# EasyEDA Pro project ProPrj_bspd _new_2026-05-23.epro

# Schematic Schematic1
Board Name: Board1; Create Date: 2026-03-17; Page Name: P1; Project Name: bspd 2; Schematic Name: Schematic1; Update Date: 2026-03-18; BladeWidth: 10; Company: 嘉立创EDA; Page Size: A4; RegionStart: 1; ShowBorder: 1; TitleBlock: 1; TitleBlockPosition: 3; Version: V1.0; XRegionCount: 6; YRegionCount: 4
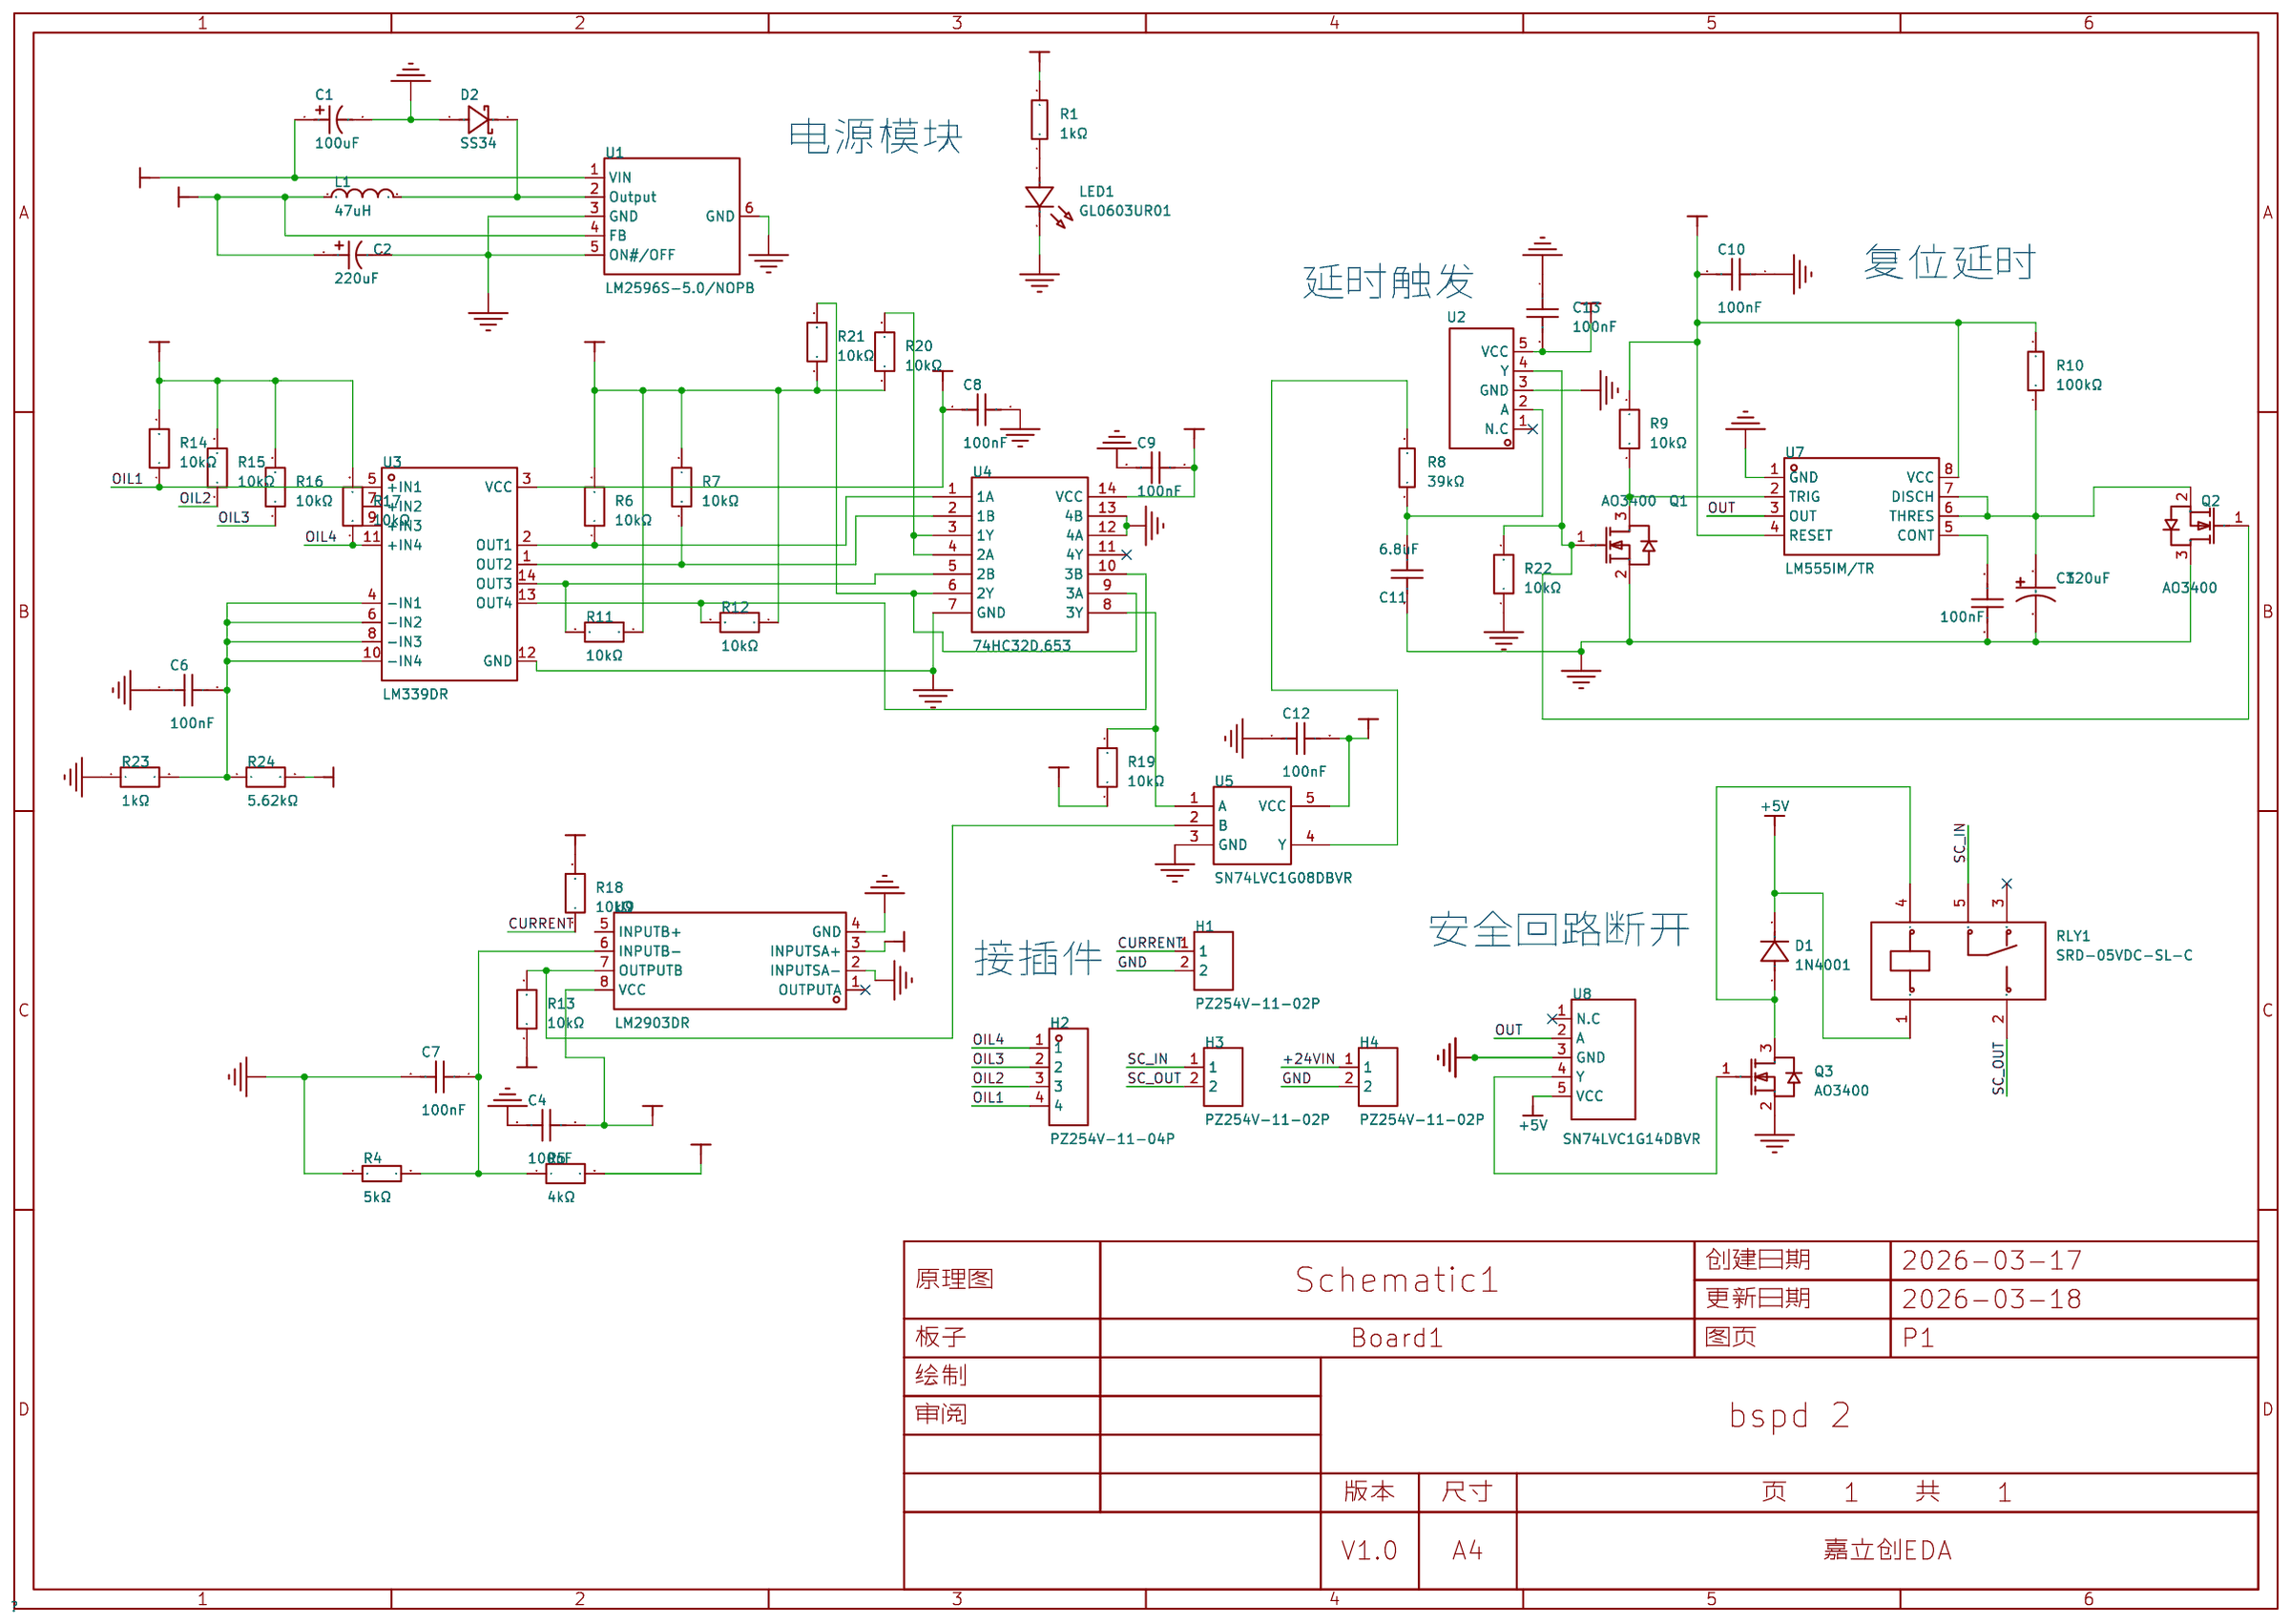
[diagram p0: schematic sheet]

## Parts
C1  100uF  [CAP-SMD_BD6.3-L6.6-W6.6-LS7.3-FD-H7.7]
C2  220uF  [CAP-SMD_BD10.0-L10.3-W10.3-LS11.7-FD]
C3  120uF  [CAP-SMD_BD6.3-L6.6-W6.6-LS7.2-FD]
C4  100nF  [C0603]
C5  100nF  [C0603]
C6  100nF  [C0603]
C7  100nF  [C0603]
C8  100nF  [C0603]
C9  100nF  [C0603]
C10  100nF  [C0603]
C11  6.8uF  [C1206]
C12  100nF  [C0603]
C13  100nF  [C0603]
D1  1N4001  [SMA_L4.3-W2.5-LS5.0-RD]
D2  SS34  [SMA_L4.3-W2.6-LS5.0-FD]
H1  PZ254V-11-02P  [HDR-TH_2P-P2.54-V-M]
H2  PZ254V-11-04P  [HDR-TH_4P-P2.54-V-M]
H3  PZ254V-11-02P  [HDR-TH_2P-P2.54-V-M]
H4  PZ254V-11-02P  [HDR-TH_2P-P2.54-V-M]
L1  47uH  [IND-SMD_L11.5-W10.5_MJC-1040T]
LED1  GL0603UR01  [LED0603-FD]
Q1  AO3400  [SOT-23_L2.9-W1.3-P1.90-LS2.4-BR]
Q2  AO3400  [SOT-23_L2.9-W1.3-P1.90-LS2.4-BR]
Q3  AO3400  [SOT-23_L2.9-W1.3-P1.90-LS2.4-BR]
R1  1kΩ  [R0603]
R4  5kΩ  [R0603]
R5  4kΩ  [R0603]
R6  10kΩ  [R0603]
R7  10kΩ  [R0603]
R8  39kΩ  [R0603]
R9  10kΩ  [R0603]
R10  100kΩ  [R0603]
R11  10kΩ  [R0603]
R12  10kΩ  [R0603]
R13  10kΩ  [R0603]
R14  10kΩ  [R0603]
R15  10kΩ  [R0603]
R16  10kΩ  [R0603]
R17  10kΩ  [R0603]
R18  10kΩ  [R0603]
R19  10kΩ  [R0603]
R20  10kΩ  [R0603]
R21  10kΩ  [R0603]
R22  10kΩ  [R0603]
R23  1kΩ  [R0603]
R24  5.62kΩ  [R0603]
RLY1  SRD-05VDC-SL-C  [RELAY-TH_SRD-XXVDC-XL-C]
U1  LM2596S-5.0/NOPB  [TO-263-5_L10.2-W8.6-P1.70-LS14.4-BR]
U2  SN74LVC1G17DBVR  [SOT-23-5_L3.0-W1.7-P0.95-LS2.8-BR]
U3  LM339DR  [SOIC-14_L8.7-W3.9-P1.27-LS6.0-BL]
U4  74HC32D,653  [SOIC-14_L8.7-W3.9-P1.27-LS6.0-BL]
U5  SN74LVC1G08DBVR  [SOT-23-5_L3.0-W1.7-P0.95-LS2.8-BR]
U7  LM555IM/TR  [SOIC-8_L4.9-W3.9-P1.27-LS6.0-BL]
U8  SN74LVC1G14DBVR  [SOT-23-5_L3.0-W1.7-P0.95-LS2.8-BR]
U9  LM2903DR  [SOP-8_L4.9-W3.9-P1.27-LS6.0-BL]

## Library data of the parts
C1 = RVT50V100M6X8: 容值:100uF;精度:±20%;额定电压:50V;纹波电流:146mA@120Hz;; LCSC Part Name: 100uF ±20% 50V; Supplier Part: C47023117; Manufacturer: JIERR(捷而瑞); Supplier Footprint: SMD,D6.3xL7.7mm; JLCPCB Part Class: Extended Part; Datasheet: https://item.szlcsc.com/datasheet/RVT50V100M6X8/49206218.html; Supplier: LCSC; Tolerance: ±20%; Voltage Rating: 50V; Ripple Current: 146mA@120Hz; Diameter: 6.3mm; Height - Seated (Max): 7.7mm; Lifetime: 2000hrs@105℃; Operating Temperature: -55℃~+105℃
C2 = JVJ50V220M10x10: 容值:220uF;精度:±20%;额定电压:50V;纹波电流:220mA@120Hz;; LCSC Part Name: 220uF ±20% 50V; Supplier Part: C46550417; Manufacturer: JIERR(捷而瑞); Supplier Footprint: SMD,D10xL10.5mm; JLCPCB Part Class: Extended Part; Datasheet: https://item.szlcsc.com/datasheet/JVJ50V220M10x10/48680111.html; Supplier: LCSC; Tolerance: ±20%; Voltage Rating: 50V; Ripple Current: 220mA@120Hz; Diameter: 10mm; Height - Seated (Max): 10.5mm; Lifetime: 2000hrs@105℃; Operating Temperature: -55℃~+105℃
C3 = EEEFKV121XSP: 容值:120uF;精度:±20%;额定电压:35V;纹波电流:280mA@100kHz;等效串联电阻(ESR):340mΩ@100kHz;; LCSC Part Name: 120uF ±20% 35V; Supplier Part: C178575; Manufacturer: PANASONIC(松下); Supplier Footprint: SMD,D6.3xL7.7mm; JLCPCB Part Class: Extended Part; Datasheet: https://item.szlcsc.com/datasheet/EEEFKV121XSP/189968.html; Supplier: LCSC; Tolerance: ±20%; Voltage Rating: 35V; Ripple Current: 280mA@100kHz; Equivalent Series Resistance(ESR): 340mΩ@100kHz; Diameter: 6.3mm; Height - Seated (Max): 8mm; Lifetime: 2000hrs@105℃; Operating Temperature: -55℃~+105℃
C4-C10 C12 C13 = CGA0603X7R104K500JT: 容值:100nF;精度:±10%;额定电压:50V;温度系数:X7R;; LCSC Part Name: 100nF ±10% 50V; Supplier Part: C6119867; Manufacturer: HRE(芯声); Supplier Footprint: 0603; JLCPCB Part Class: 扩展库; Datasheet: https://item.szlcsc.com/datasheet/CGA0603X7R104K500JT/7062573.html; Supplier: LCSC; Tolerance: ±10%; Voltage Rating: 50V; Temperature Coefficient: X7R
C11 = C3216X5R1H685KT000N: 容值:6.8uF;精度:±10%;额定电压:50V;温度系数:X5R;; LCSC Part Name: 6.8uF ±10% 50V; Supplier Part: C342643; Manufacturer: TDK; Supplier Footprint: 1206; JLCPCB Part Class: Extended Part; Datasheet: https://item.szlcsc.com/datasheet/C3216X5R1H685KT000N/319493.html; Supplier: LCSC; Tolerance: ±10%; Voltage Rating: 50V; Temperature Coefficient: X5R
D1 = 1N4001_C727079: 二极管配置:独立式;正向压降(Vf):1.1V@1A;直流反向耐压(Vr):50V;整流电流:1A;; Supplier Part: C727079; Manufacturer: TWGMC(迪嘉); Supplier Footprint: SMA(DO-214AC); JLCPCB Part Class: 扩展库; Datasheet: https://item.szlcsc.com/datasheet/1N4001/774184.html; Supplier: LCSC; Diode Configuration: 独立式; Voltage - Forward(Vf@If): 1.1V@1A; Voltage - DC Reverse(Vr): 50V; Current - Rectified: 1A; Reverse Leakage Current (Ir): 5uA
D2 = SS34_C7420365: 二极管配置:独立式;正向压降(Vf):550mV@3A;直流反向耐压(Vr):40V;整流电流:3A;; LCSC Part Name: 电压:40V 电流:3A; Supplier Part: C7420365; Manufacturer: R+O(宏嘉诚); Supplier Footprint: SMA(DO-214AC); JLCPCB Part Class: Extended Part; Datasheet: https://item.szlcsc.com/datasheet/SS34/8397187.html; Supplier: LCSC; Diode Configuration: 独立式; Voltage - Forward(Vf@If): 550mV@3A; Voltage - DC Reverse(Vr): 40V; Current - Rectified: 3A; Reverse Leakage Current (Ir): 200uA@40V
H1 H3 H4 = PZ254V-11-02P: 插针结构:1x2P;间距:2.54mm;行距:-;圆针/方针:方针;安装方式:直插;排数:单排;总PIN位数:2P;额定电流:-;额定电压:-;配合针长度:6mm;塑高:2.5mm;端接针长度:3mm;触头材质:黄铜;触头镀层:-;工作温度:-40℃~+105℃;颜色:黑色;; LCSC Part Name: 1x2P 间距:2.54mm 方针 直插; Supplier Part: C492401; Manufacturer: XFCN(兴飞); Supplier Footprint: 插件,P=2.54mm; JLCPCB Part Class: 扩展库; Datasheet: https://item.szlcsc.com/datasheet/PZ254V-11-02P/502957.html; Supplier: LCSC; Pin Structure: 1x2P; Pitch: 2.54mm; Circluar Pins/Square Pins: 方针; Mounting Type: 直插; Number of Rows: 单排; Number of Pins: 2P; Length of Mating Pin: 6mm; Insulation Height: 2.5mm; Length of End Connection Pin: 3mm; Contact Material: 黄铜; Operating Temperature: -40℃~+105℃; Color: 黑色
H2 = PZ254V-11-04P: 插针结构:1x4P;间距:2.54mm;行距:-;圆针/方针:方针;安装方式:直插;排数:单排;总PIN位数:4P;额定电流:3A;额定电压:250V;配合针长度:6mm;塑高:2.5mm;端接针长度:3mm;触头材质:-;工作温度:-40℃~+105℃;颜色:黑色;; LCSC Part Name: 1x4P 间距:2.54mm 方针 直插; Supplier Part: C2691448; Manufacturer: XFCN(兴飞); Supplier Footprint: 插件,P=2.54mm; JLCPCB Part Class: 扩展库; Datasheet: https://item.szlcsc.com/datasheet/PZ254V-11-04P/2801085.html; Supplier: LCSC; Pin Structure: 1x4P; Pitch: 2.54mm; Circluar Pins/Square Pins: 方针; Mounting Type: 直插; Number of Rows: 单排; Number of Pins: 4P; Current Rating: 3A; Voltage Rating (Max): 250V; Length of Mating Pin: 6mm; Insulation Height: 2.5mm; Length of End Connection Pin: 3mm; Operating Temperature: -40℃~+105℃; Color: 黑色
L1 = PCR1040-470-M: 电感值:47uH;精度:±20%;额定电流:3A;饱和电流(Isat):3.5A;类型:一体成型电感;; LCSC Part Name: 47μH ±20% 3.5A; Supplier Part: C53896895; Manufacturer: JIERR(捷而瑞); Supplier Footprint: SMD,11.5x10.5mm; JLCPCB Part Class: Extended Part; Datasheet: https://item.szlcsc.com/datasheet/PCR1040-470-M/57092577.html; Supplier: LCSC; Tolerance: ±20%; Current Rating: 3A; Current - Saturation(Isat): 3.5A; DC Resistance(DCR): 165mΩ; Type: 一体成型电感
LED1 = GL0603UR01: 发光颜色:红色;正向压降(Vf):2.4V;正向电流:20mA;波长:620nm~625nm;二极管配置:独立二极管;透镜颜色:无色透明透镜;发光强度:120mcd;发光角度:120°;载带方式:正贴;工作温度:-40℃~+85℃;; LCSC Part Name: 0603 红灯 高亮; Supplier Part: C51933292; Manufacturer: Guiguang light(桂光光电); Supplier Footprint: 0603; JLCPCB Part Class: Extended Part; Datasheet: https://item.szlcsc.com/datasheet/GL0603UR01/54645988.html; Supplier: LCSC; Illumination Color: 红色; Voltage - Forward(Vf): 2.4V; Forward Current: 20mA; Wavelength - Dominant: 620nm~625nm; Diode Configuration: 独立二极管; Lens Color: 无色透明透镜; Luminous Intensity: 120mcd; Viewing Angle: 120°; Mounting Style: 正贴; Operating Temperature: -40℃~+85℃
Q1-Q3 = AO3400_C2938367: 数量:1个N沟道;漏源电压(Vdss):30V;连续漏极电流(Id):5.8A;导通电阻(RDS(on)):28mΩ@10V;耗散功率(Pd):1.5W;阈值电压(Vgs(th)):1.4V@250uA;; LCSC Part Name: 1个N沟道 耐压:30V 电流:5.8A; Supplier Part: C2938367; Manufacturer: GOODWORK(固得沃克); Supplier Footprint: SOT-23; JLCPCB Part Class: 扩展库; Datasheet: https://item.szlcsc.com/datasheet/AO3400/3294704.html; Supplier: LCSC; Number: 1个N沟道; Drain to Source Voltage: 30V; Current - Continuous Drain(Id): 5.8A; RDS(on): 28mΩ@10V; Pd - Power Dissipation: 1.5W; Gate Threshold Voltage (Vgs(th)): 1.4V@250uA; Input Capacitance(Ciss): 1.05nF; Reverse Transfer Capacitance (Crss@Vds): 77pF@15V; Operating Temperature: -55℃~+150℃; Type: N沟道
R1 = 0603WAF1001T5E: 电阻类型:厚膜电阻;阻值:1kΩ;精度:±1%;功率:100mW;工作电压:75V;温度系数:±100ppm/℃;; LCSC Part Name: 1kΩ ±1% 100mW 厚膜电阻; Supplier Part: C21190; Manufacturer: UNI-ROYAL(厚声); Supplier Footprint: 0603; JLCPCB Part Class: 基础库; Datasheet: https://item.szlcsc.com/datasheet/0603WAF1001T5E/21904.html; Supplier: LCSC; Type: 厚膜电阻; Tolerance: ±1%; Power(Watts): 100mW; Voltage-Supply(Max): 75V; Temperature Coefficient: ±100ppm/℃; Operating Temperature: -55℃~+155℃
R4 = RT0603BRE075KL: 电阻类型:薄膜电阻;阻值:5kΩ;精度:±0.1%;功率:100mW;温度系数:±50ppm/℃;; LCSC Part Name: 薄膜电阻 5kΩ ±0.1% 100mW; Supplier Part: C862232; Manufacturer: YAGEO(国巨); Supplier Footprint: 0603; JLCPCB Part Class: Extended Part; Datasheet: https://atta.szlcsc.com/upload/public/pdf/source/20200610/C326738_5639A9F1B6EB6E4AE2197577D3456E7F.pdf; Supplier: LCSC; Type: 薄膜电阻; Tolerance: ±0.1%; Power(Watts): 100mW; Temperature Coefficient: ±50ppm/℃; Operating Temperature Range: -55℃~+155℃
R5 = ARG03FTC4001N: 电阻类型:薄膜电阻;阻值:4kΩ;精度:±1%;功率:100mW;工作电压:75V;温度系数:±25ppm/℃;; LCSC Part Name: 薄膜电阻 4kΩ ±1% 100mW 停产; Supplier Part: C2984443; Manufacturer: Viking(光颉); Supplier Footprint: 0603; JLCPCB Part Class: Extended Part; Datasheet: https://item.szlcsc.com/datasheet/ARG03FTC4001N/3425978.html; Supplier: LCSC; Type: 薄膜电阻; Tolerance: ±1%; Power(Watts): 100mW; Voltage-Supply(Max): 75V; Temperature Coefficient: ±25ppm/℃; Operating Temperature: -55℃~+155℃
R6 R7 R9 R11-R22 = FRC0603F1002TS: 电阻类型:厚膜电阻;阻值:10kΩ;精度:±1%;功率:100mW;工作电压:75V;温度系数:±100ppm/℃;; LCSC Part Name: 10kΩ ±1% 100mW 厚膜电阻; Supplier Part: C2906982; Manufacturer: FOJAN(富捷); Supplier Footprint: 0603; JLCPCB Part Class: 扩展库; Supplier: LCSC; Type: 厚膜电阻; Tolerance: ±1%; Power(Watts): 100mW; Voltage-Supply(Max): 75V; Temperature Coefficient: ±100ppm/℃; Operating Temperature: -55℃~+155℃
R8 = 0603WAF3903T5E: 电阻类型:厚膜电阻;阻值:390kΩ;精度:±1%;功率:100mW;工作电压:75V;温度系数:±100ppm/℃;; LCSC Part Name: 390kΩ ±1% 100mW 厚膜电阻; Supplier Part: C23150; Manufacturer: UNI-ROYAL(厚声); Supplier Footprint: 0603; JLCPCB Part Class: 扩展库; Datasheet: https://item.szlcsc.com/datasheet/0603WAF3903T5E/23877.html; Supplier: LCSC; Type: 厚膜电阻; Tolerance: ±1%; Power(Watts): 100mW; Voltage-Supply(Max): 75V; Temperature Coefficient: ±100ppm/℃; Operating Temperature: -55℃~+155℃
R10 = RC0603FR-07100KL: 电阻类型:厚膜电阻;阻值:100kΩ;精度:±1%;功率:100mW;最大工作电压:75V;温度系数:±100ppm/℃;; LCSC Part Name: 厚膜电阻 100kΩ ±1% 100mW; Supplier Part: C14675; Manufacturer: YAGEO(国巨); Supplier Footprint: 0603; JLCPCB Part Class: 扩展库; Datasheet: https://atta.szlcsc.com/upload/public/pdf/source/20140324/1457707028752.pdf; Supplier: LCSC; Type: 厚膜电阻; Tolerance: ±1%; Power(Watts): 100mW; Overload Voltage (Max): 75V; Temperature Coefficient: ±100ppm/℃; Operating Temperature Range: -55℃~+155℃
R23 = FRC0603F1001TS: 电阻类型:厚膜电阻;阻值:1kΩ;精度:±1%;功率:100mW;工作电压:75V;温度系数:±100ppm/℃;; LCSC Part Name: 1kΩ ±1% 100mW 厚膜电阻; Supplier Part: C2907002; Manufacturer: FOJAN(富捷); Supplier Footprint: 0603; JLCPCB Part Class: Extended Part; Supplier: LCSC; Type: 厚膜电阻; Tolerance: ±1%; Power(Watts): 100mW; Voltage-Supply(Max): 75V; Temperature Coefficient: ±100ppm/℃; Operating Temperature: -55℃~+155℃
R24 = FRC0603F5621TS: 电阻类型:厚膜电阻;阻值:5.62kΩ;精度:±1%;功率:100mW;工作电压:75V;温度系数:±100ppm/℃;; LCSC Part Name: 5.62kΩ ±1% 100mW 厚膜电阻; Supplier Part: C2930113; Manufacturer: FOJAN(富捷); Supplier Footprint: 0603; JLCPCB Part Class: Extended Part; Supplier: LCSC; Type: 厚膜电阻; Tolerance: ±1%; Power(Watts): 100mW; Voltage-Supply(Max): 75V; Temperature Coefficient: ±100ppm/℃; Operating Temperature: -55℃~+155℃
RLY1 = SRD-05VDC-SL-C: 线圈电压:5V;触点形式:一组转换:1C(单刀双掷-转换);触点容量(电阻负载):-;最大切换电压:250V@AC;最大切换电流:15A;; LCSC Part Name: 蓝色 单组转换型继电器; Supplier Part: C35449; Manufacturer: 松乐; Supplier Footprint: 插件,15.6x19.2mm; JLCPCB Part Class: 扩展库; Datasheet: https://item.szlcsc.com/datasheet/SRD-05VDC-SL-C/36422.html; Supplier: LCSC; Coil Voltage: 5V; Contact Form: 一组转换:1C(单刀双掷-转换); Number of Pins: 5; Switching Voltage(Max): 250V@AC; Coil Rated Power: 360mW; Switching Current(Max): 15A; Coil Type: 无极性-单线圈; Coil Resistance: 70Ω; Contact Resistance: 100mΩ; Operate Time: 10ms; Release Time: 10ms
U1 = LM2596S-5.0/NOPB: 功能类型:降压型;输出类型:固定;工作电压:4.5V~40V;输出电压:5V;输出电流:3A;; LCSC Part Name: LM2596 150-kHz 3-A 降压稳压器; Supplier Part: C116713; Manufacturer: TI(德州仪器); Supplier Footprint: TO-263-5; JLCPCB Part Class: Extended Part; Datasheet: https://www.ti.com/cn/lit/gpn/lm2596; Supplier: LCSC; Function: 降压型; Output Type: 固定; Voltage - Supply: 4.5V~40V; Output Voltage: 5V; Output Current: 3A; Frequency - Switching: 150kHz; Operating Temperature: -40℃~+125℃@(TJ); Synchronous Rectifier: 否; Number of Outputs: 1; Topology: 降压式; Switch tube (built-in/external): 内置
U2 = SN74LVC1G17DBVR: 输入类型:施密特触发器;工作电压:1.65V~5.5V;元件数:1;每个元件位数:1;灌电流(IOL):32mA;拉电流(IOH):32mA;; LCSC Part Name: 单施密特触发器缓冲器; Supplier Part: C7836; Manufacturer: TI(德州仪器); Supplier Footprint: SOT-23-5; JLCPCB Part Class: Extended Part; Datasheet: https://www.ti.com/cn/lit/gpn/sn74lvc1g17; Supplier: LCSC; Input type: 施密特触发器; output type: 推挽式; Voltage - Supply: 1.65V~5.5V; Number of Elements: 1; Number of Bits per Element: 1; Current - Output Low(IOL): 32mA; Current - Output High(IOH): 32mA; Logic Family: 74LVC; Operating Temperature: -40℃~+125℃; Quiescent Current: 10uA; Propagation Delay: 4.6ns@3.3V,15pF
U3 = LM339DR_C5236695: 比较器数:四路;输入失调电压(Vos):2mV;输入偏置电流(Ib):25nA;; LCSC Part Name: 宽电源范围、低输入偏置电流的比较器; Supplier Part: C5236695; Manufacturer: UMW(友台半导体); Supplier Footprint: SOP-14; JLCPCB Part Class: 扩展库; Datasheet: https://item.szlcsc.com/datasheet/LM339DR/5939954.html; Supplier: LCSC; Number of Channels: 四路; Vos - Input Offset Voltage: 2mV; Ib - Input Bias Current: 25nA; Propagation Delay Time: 300ns; Output Mode: TTL；CMOS; Quiescent Current: 800uA; Operating Temperature: 0℃~+70℃; Maximum Power Supply Range (Vdd-Vss): 36V; Single Supply: 2V~36V; Dual Supply: 1V~18V；-18V~-1V; Input Offset Current(Ios): 5nA; Response Time (tr): 1.3us
U4 = 74HC32D,653: 逻辑类型:或门;通道数:4;电源电压:2V~6V;静态电流(最大值):2uA;最大传播延迟:15ns@6V,50pF;; Supplier Part: C5632; Manufacturer: Nexperia(安世); Supplier Footprint: SOIC-14; JLCPCB Part Class: Extended Part; Datasheet: https://atta.szlcsc.com/upload/public/pdf/source/20120419/1457706475969.pdf; Supplier: LCSC; Logic Gate Type: 或门; Number of Channels: 4; Supply Voltage: 2V~6V; Quiescent Current (Max): 2uA; Sink Current: 5.2mA; Source Current: 5.2mA; High Level Range (VIH): 1.5V~4.2V; Low Level Range (VIL): 500mV~1.8V; Series: 74HC系列; Propagation Delay Time: 15ns@6V,50pF; Operating Temperature: -40℃~+125℃
U5 = SN74LVC1G08DBVR: 逻辑类型:与门;通道数:1;工作电压:1.65V~5.5V;静态电流(Iq):10uA;传播延迟(tpd):4ns@5V,50pF;; LCSC Part Name: 单路 2 输入正与门; Supplier Part: C7666; Manufacturer: TI(德州仪器); Supplier Footprint: SOT-23-5; JLCPCB Part Class: 扩展库; Datasheet: https://www.ti.com/cn/lit/gpn/sn74lvc1g08; Supplier: LCSC; Logic Type: 与门; Number of Channels: 1; Voltage - Supply: 1.65V~5.5V; Quiescent Current: 10uA; Current - Output Low(IOL): 32mA; Current - Output High(IOH): 32mA; Input Logic Level - High: 2V；1.7V; Input Logic Level - Low: 800mV；700mV; Output Logic Level - High: 1.9V；2.3V；1.2V；3.8V; Output Logic Level - Low: 550mV；300mV；450mV; Series: 74LVC系列; Propagation Delay: 4ns@5V,50pF; Operating Temperature: -40℃~+125℃; Input Number: 2
U7 = LM555IM/TR: 定时器/计时器/时钟振荡器  高精度定时脉冲的双极性集成电路; Supplier Part: C19193454; Manufacturer: HGSEMI(华冠); Supplier Footprint: SOP-8; JLCPCB Part Class: Extended Part; Datasheet: https://item.szlcsc.com/datasheet/LM555IM%252FTR/20442266.html; Supplier: LCSC
U8 = SN74LVC1G14DBVR: 输入类型:施密特触发器;工作电压:1.65V~5.5V;工作电流:10uA;通道数:1;传播延迟(tpd):6.5ns@2.5V,50pF;; LCSC Part Name: 单路施密特触发反相器; Supplier Part: C7835; Manufacturer: TI(德州仪器); Supplier Footprint: SOT-23-5; JLCPCB Part Class: 扩展库; Datasheet: https://www.ti.com/cn/lit/gpn/sn74lvc1g14; Supplier: LCSC; Input Type: 施密特触发器; Voltage - Supply: 1.65V~5.5V; Current - Supply: 10uA; Number of Circuits: 1; Number of Inputs: 1; Current - Output Low(IOL): 32mA; Current - Output High(IOH): 32mA; Input Logic Level - High: 1.16V~3.33V; Input Logic Level -Low: 390mV~1.87V; Max Propagation Delay: 6.5ns@2.5V,50pF; Series: 74LVC系列
U9 = LM2903DR_C668214: 比较器数:双路;输入失调电压(Vos):1mV;输入偏置电流(Ib):25nA;轨到轨:-;; Supplier Part: C668214; Manufacturer: UMW(友台半导体); Supplier Footprint: SOP-8; JLCPCB Part Class: 扩展库; Datasheet: https://item.szlcsc.com/datasheet/LM2903DR/698062.html; Supplier: LCSC; Number of Channels: 双路; Vos - Input Offset Voltage: 1mV; Ib - Input Bias Current: 25nA; Voltage - Supply: 2V~30V；-15V~-1V；1V~15V; Quiescent Current per Amplifier: 400uA; Operating Temperature: 0℃~+70℃

## Nets
+5V: C2.1 C4.1 C8.2 C9.1 C10.2 C12.2 C13.2 D1.1(K) L1.1 R1.2 R5.2 R6.2 R7.1 R9.2 R10.2 R11.1 R12.1 R13.1 R14.2 R15.2 R16.2 R17.2 R18.2 R19.1 R20.1 R21.1 R24.2 RLY1.1 U1.4(FB) U2.5(VCC) U3.3(VCC) U4.14(VCC) U5.5(VCC) U7.4(RESET) U7.8(VCC) U8.5(VCC) U9.3(INPUTSA+) U9.8(VCC)
+24VIN: C1.1 H4.1 U1.1(VIN)
GND: C1.2 C2.2 C3.2 C4.2 C5.1 C6.2 C7.2 C8.1 C9.2 C10.1 C11.1 C12.1 C13.1 D2.1(A) H1.2 H4.2 LED1.2(C) Q1.2(S) Q2.3(D) Q3.2(S) R4.1 R22.1 R23.1 U1.3(GND) U1.5(ON#/OFF) U1.6(GND) U2.3(GND) U3.12(GND) U4.7(GND) U4.12(4A) U4.13(4B) U5.3(GND) U7.1(GND) U8.3(GND) U9.2(INPUTSA-) U9.4(GND)
CURRENT: H1.1 R18.1 U9.5(INPUTB+)
OIL1: H2.4 R14.1 U3.5(+IN1)
OIL2: H2.3 R15.1 U3.7(+IN2)
OIL3: H2.2 R16.1 U3.9(+IN3)
OIL4: H2.1 R17.1 U3.11(+IN4)
OUT: U7.3(OUT) U8.2(A)
SC_IN: H3.1 RLY1.5
SC_OUT: H3.2 RLY1.2
$1N1139: C6.1 R23.2 R24.1 U3.4(-IN1) U3.6(-IN2) U3.8(-IN3) U3.10(-IN4)
$1N1617: R6.1 U3.2(OUT1) U4.1(1A)
$1N1644: R11.2 U3.14(OUT3) U4.5(2B)
$1N2028: C7.1 R4.2 R5.1 U9.6(INPUTB-)
$1N2830: Q1.1(G) Q2.1(G) R22.2 U2.4(Y)
$1N2952: Q1.3(D) R9.1 U7.2(TRIG)
$1N3199: C3.1 Q2.2(S) R10.1 U7.6(THRES) U7.7(DISCH)
$1N3222: C5.2 U7.5(CONT)
$1N3577: Q3.1(G) U8.4(Y)
$1N3579: D1.2(A) Q3.3(D) RLY1.4
$1N6050: D2.2(K) L1.2 U1.2(Output)
$1N6054: LED1.1(A) R1.1
$1N6066: R12.2 U3.13(OUT4) U4.10(3B)
$1N6081: R7.2 U3.1(OUT2) U4.2(1B)
$1N6083: R20.2 U4.3(1Y) U4.4(2A)
$1N6088: R21.2 U4.6(2Y) U4.9(3A)
$1N6089: R19.2 U4.8(3Y) U5.1(A)
$1N6114: R13.2 U5.2(B) U9.7(OUTPUTB)
$1N6121: C11.2 R8.1 U2.2(A)
$1N6129: R8.2 U5.4(Y)

Not connected (* = marked no-connect by the designer): RLY1 3*; U2 1(N.C)*; U4 11(4Y)*; U8 1(N.C)*; U9 1(OUTPUTA)*

## Notes on the sheet
- 电源模块
- 复位延时
- 延时触发
- 安全回路断开
- 接插件

# Board PCB1
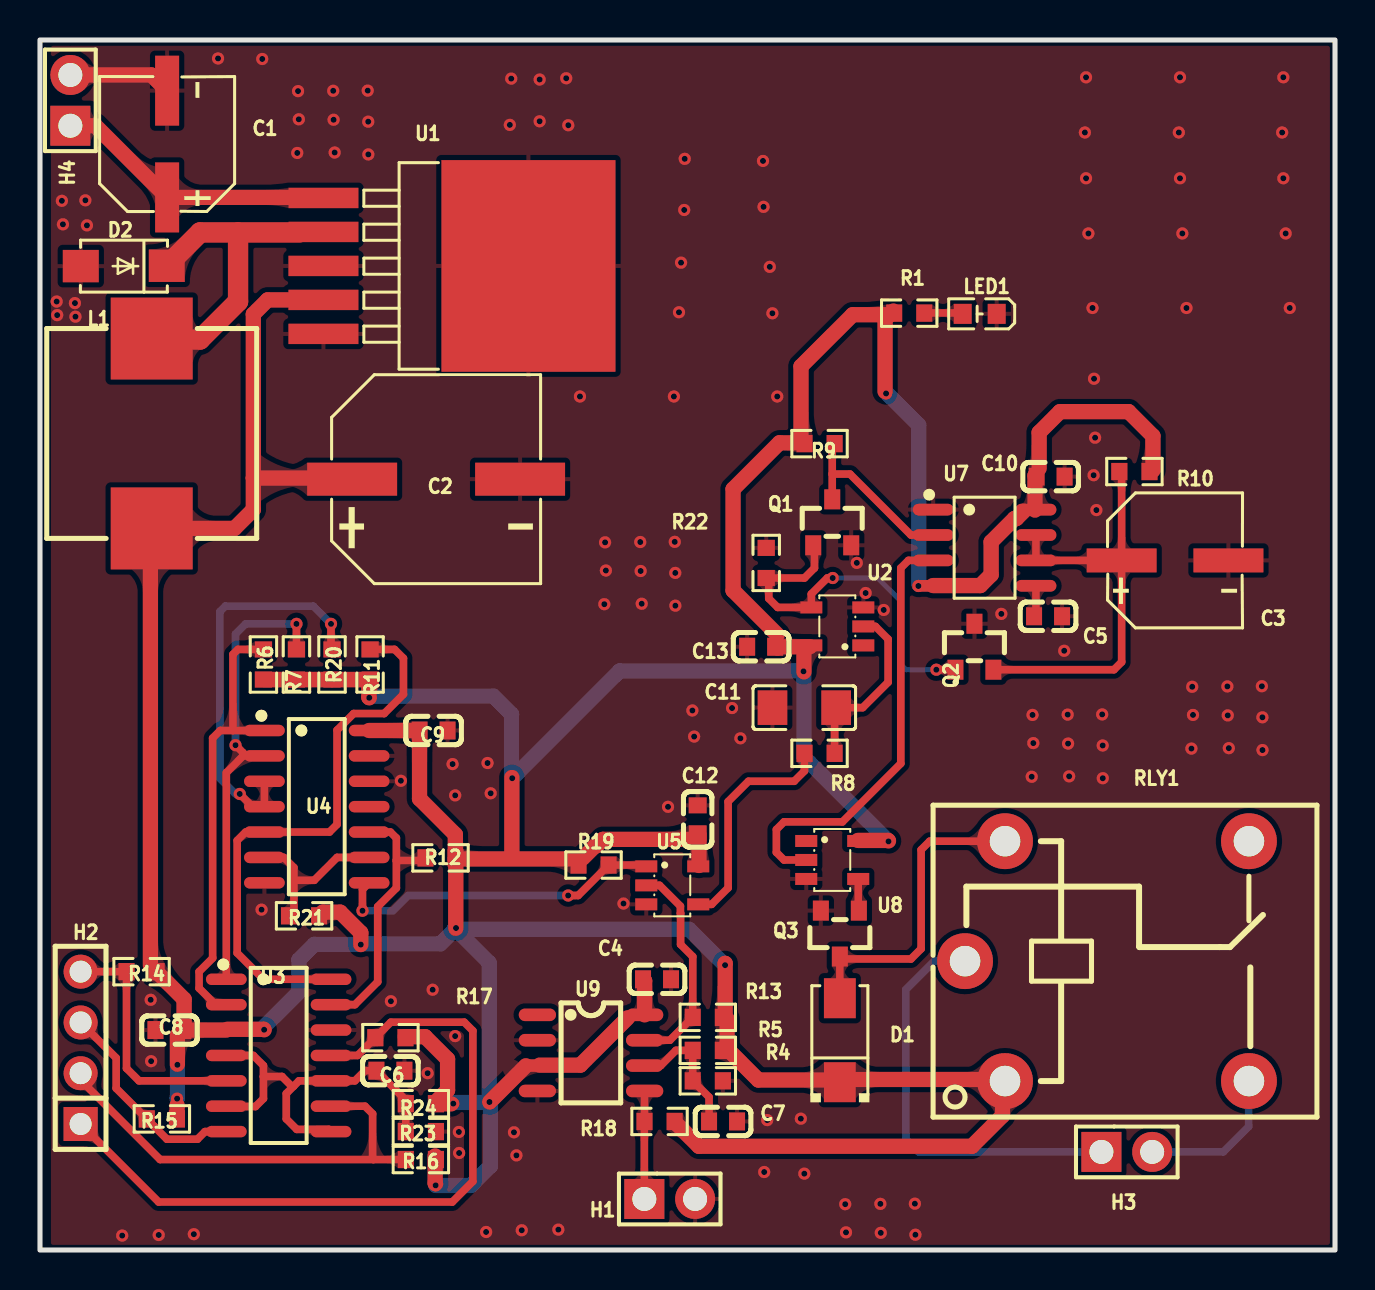
[diagram p1: board, top side]
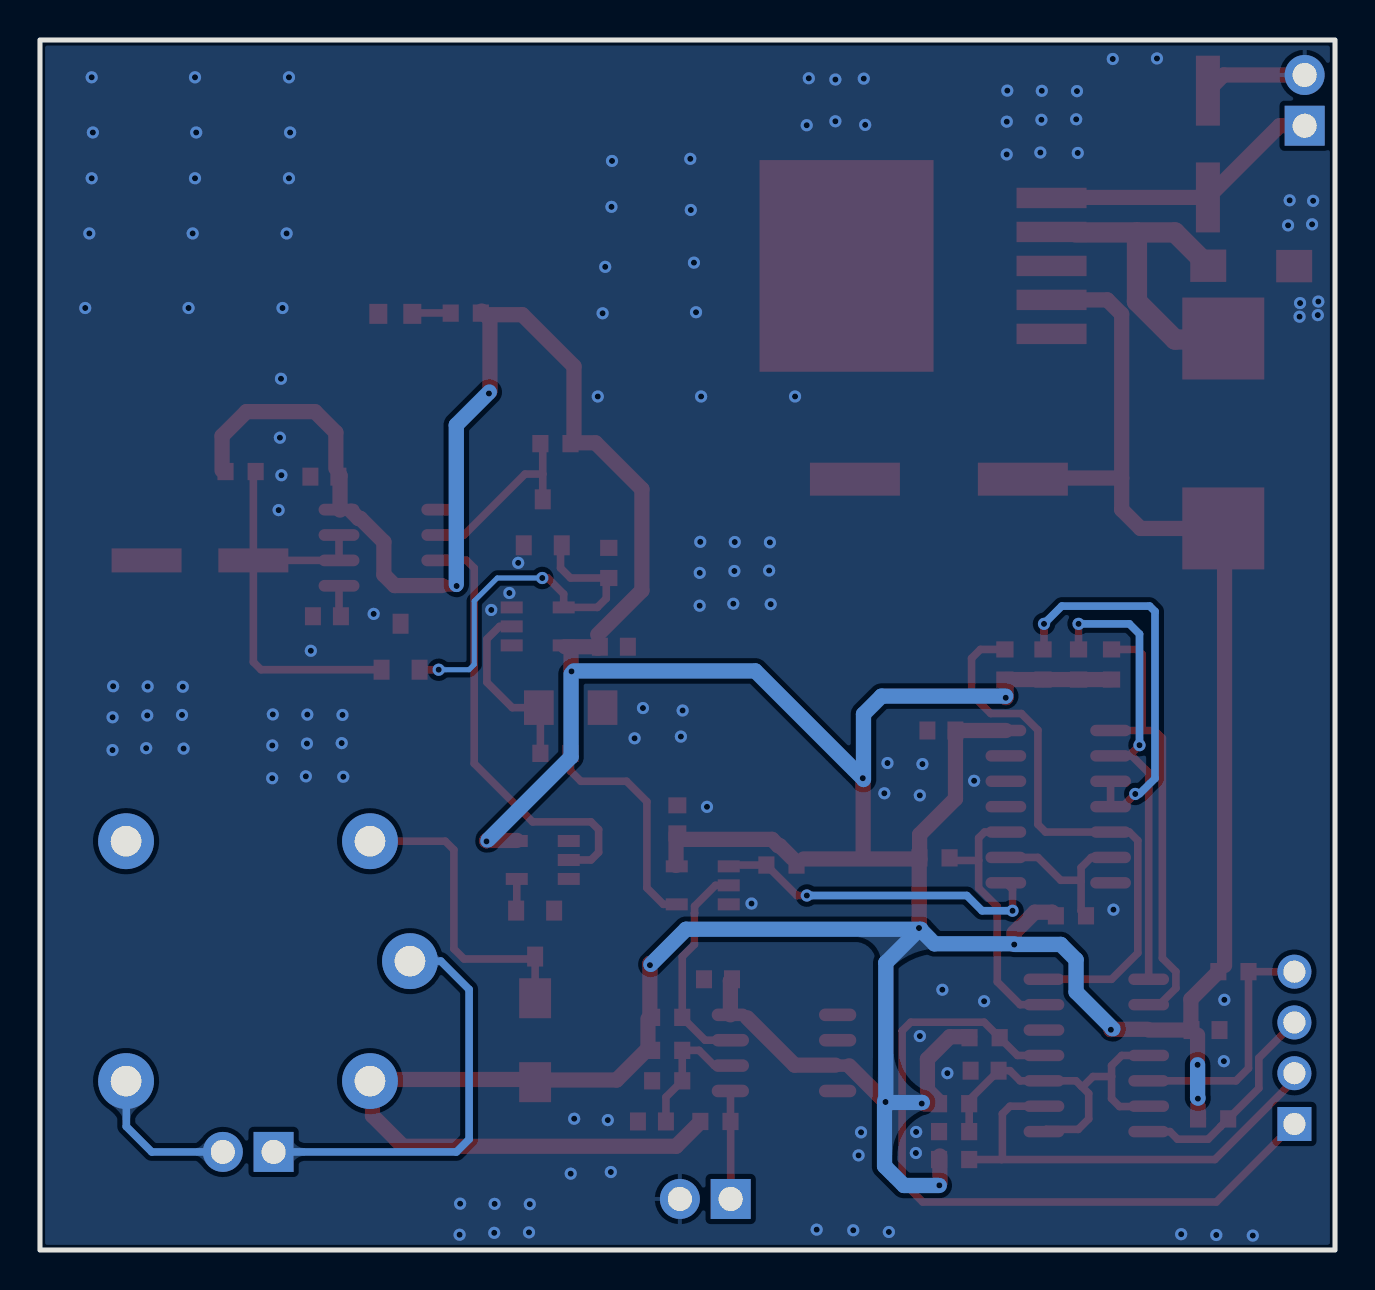
[diagram p2: board, bottom side, seen from below]

Outline 64.77 x 60.53 mm; copper layers: Top Layer, Bottom Layer. Coordinates in mm from the lower left corner of the outline.
Outline path: rectangle 0,60.53 64.77,0
Stack: Top Layer 0.035mm / Dielectric1 1.51mm FR4 er 4.5 / Bottom Layer 0.035mm

## Design rules (mm)
spacing copperThickness1oz (default): track to track 0.102, other pairs 0.152 to 0.3
spacing copperThickness2oz: track to track 0.203, other pairs 0.152 to 0.3
spacing Plane_innerPlane: track to track 0.102, other pairs 0.152 to 0.3
spacing Copper_copperRegion: track to track 0.102, other pairs 0.152 to 0.3
track width copperThickness1oz (default): min 0.127, default 0.254, max 2.54
track width copperThickness2oz: min 0.203, default 0.254, max 2.54
differential pair differentialPair (default): width min 0.127, default 0.254, max 2.54; gap min 0.152, default 0.152
net GND uses copperRegion_copperThickness1oz
pour e718 uses Copper_copperRegion, copperRegion_Copper_copperRegion
pour e832 uses Copper_copperRegion, copperRegion_Copper_copperRegion

## Placement (name value [footprint] x y rotation side)
C1  100uF  [CAP-SMD_BD6.3-L6.6-W6.6-LS7.3-FD-H7.7]  6.36 55.33 90 top
C2  220uF  [CAP-SMD_BD10.0-L10.3-W10.3-LS11.7-FD]  19.81 38.56 0 top
C3  120uF  [CAP-SMD_BD6.3-L6.6-W6.6-LS7.2-FD]  56.77 34.5 0 top
C4  100nF  [C0603]  30.86 13.54 0 top
C5  100nF  [C0603]  50.42 31.7 180 top
C6  100nF  [C0603]  17.53 8.97 0 top
C7  100nF  [C0603]  34.16 6.43 0 top
C8  100nF  [C0603]  6.48 11 0 top
C9  100nF  [C0603]  19.69 25.99 0 top
C10  100nF  [C0603]  50.55 38.69 180 top
C11  6.8uF  [C1206]  38.23 27.13 0 top
C12  100nF  [C0603]  32.89 21.55 270 top
C13  100nF  [C0603]  36.07 30.18 0 top
D1  1N4001  [SMA_L4.3-W2.5-LS5.0-RD]  40.01 10.5 90 top
D2  SS34  [SMA_L4.3-W2.6-LS5.0-FD]  4.19 49.23 0 top
H1  PZ254V-11-02P  [HDR-TH_2P-P2.54-V-M]  31.5 2.55 0 top
H2  PZ254V-11-04P  [HDR-TH_4P-P2.54-V-M]  2.03 10.11 90 top
H3  PZ254V-11-02P  [HDR-TH_2P-P2.54-V-M]  54.36 4.91 0 top
H4  PZ254V-11-02P  [HDR-TH_2P-P2.54-V-M]  1.52 57.51 90 top
L1  47uH  [IND-SMD_L11.5-W10.5_MJC-1040T]  5.59 40.85 90 top
LED1  GL0603UR01  [LED0603-FD]  47 46.83 0 top
Q1  AO3400  [SOT-23_L2.9-W1.3-P1.90-LS2.4-BR]  39.62 36.4 270 top
Q2  AO3400  [SOT-23_L2.9-W1.3-P1.90-LS2.4-BR]  46.74 30.18 270 top
Q3  AO3400  [SOT-23_L2.9-W1.3-P1.90-LS2.4-BR]  40.01 15.83 90 top
R1  1kΩ  [R0603]  43.47 46.87 180 top
R4  5kΩ  [R0603]  33.4 8.46 180 top
R5  4kΩ  [R0603]  33.4 9.99 0 top
R6  10kΩ  [R0603]  11.18 29.29 270 top
R7  10kΩ  [R0603]  12.83 29.29 90 top
R8  39kΩ  [R0603]  38.99 24.85 180 top
R9  10kΩ  [R0603]  38.99 40.34 180 top
R10  100kΩ  [R0603]  54.74 38.94 0 top
R11  10kΩ  [R0603]  16.51 29.29 90 top
R12  10kΩ  [R0603]  20.03 19.62 180 top
R13  10kΩ  [R0603]  33.4 11.64 180 top
R14  10kΩ  [R0603]  5.08 13.92 0 top
R15  10kΩ  [R0603]  6.1 6.56 0 top
R16  10kΩ  [R0603]  19.05 4.53 0 top
R17  10kΩ  [R0603]  17.53 10.62 0 top
R18  10kΩ  [R0603]  30.99 6.43 0 top
R19  10kΩ  [R0603]  27.69 19.26 0 top
R20  10kΩ  [R0603]  14.61 29.29 90 top
R21  10kΩ  [R0603]  13.21 16.72 180 top
R22  10kΩ  [R0603]  36.32 34.37 270 top
R23  1kΩ  [R0603]  19.05 5.92 180 top
R24  5.62kΩ  [R0603]  19.05 7.32 0 top
RLY1  SRD-05VDC-SL-C  [RELAY-TH_SRD-XXVDC-XL-C]  53.37 14.45 0 top
U1  LM2596S-5.0/NOPB  [TO-263-5_L10.2-W8.6-P1.70-LS14.4-BR]  19.3 49.23 180 top
U2  SN74LVC1G17DBVR  [SOT-23-5_L3.0-W1.7-P0.95-LS2.8-BR]  39.88 31.2 0 top
U3  LM339DR  [SOIC-14_L8.7-W3.9-P1.27-LS6.0-BL]  11.94 9.73 270 top
U4  74HC32D,653  [SOIC-14_L8.7-W3.9-P1.27-LS6.0-BL]  13.84 22.18 270 top
U5  SN74LVC1G08DBVR  [SOT-23-5_L3.0-W1.7-P0.95-LS2.8-BR]  31.62 18.24 180 top
U7  LM555IM/TR  [SOIC-8_L4.9-W3.9-P1.27-LS6.0-BL]  47.24 35.13 270 top
U8  SN74LVC1G14DBVR  [SOT-23-5_L3.0-W1.7-P0.95-LS2.8-BR]  39.62 19.51 180 top
U9  LM2903DR  [SOP-8_L4.9-W3.9-P1.27-LS6.0-BL]  27.56 9.86 270 top

## Footprints (pads in the part's own frame, mm; a bottom-side part is the same pattern mirrored in y, then rotated)
C0603
  rect 0.8x0.9 smd: 1(-0.7,0) 2(0.7,0)
C1206
  rect 1.485x1.728 smd: 1(-1.593,0) 2(1.593,0)
CAP-SMD_BD6.3-L6.6-W6.6-LS7.2-FD
  rect 3.5x1.2 smd: 1(-2.67,0) 2(2.67,0)
CAP-SMD_BD6.3-L6.6-W6.6-LS7.3-FD-H7.7
  rect 3.5x1.2 smd: 1(-2.67,0) 2(2.67,0)
CAP-SMD_BD10.0-L10.3-W10.3-LS11.7-FD
  rect 4.5x1.65 smd: 1(-4.2,0) 2(4.2,0)
HDR-TH_2P-P2.54-V-M
  rect 2x2 hole 1.2: 1(-1.27,0)
  round 2 hole 1.2: 2(1.27,0)
HDR-TH_4P-P2.54-V-M
  rect 1.7x1.7 hole 1.1: 1(-3.81,0)
  round 1.7 hole 1.1: 2(-1.27,0) 3(1.27,0) 4(3.81,0)
IND-SMD_L11.5-W10.5_MJC-1040T
  rect 4.1x4.1 smd: 1(-4.75,0) 2(4.75,0)
LED0603-FD
  rect 0.9x1 smd: 1(-0.85,0) 2(0.85,0)
R0603
  rect 0.806x0.864 smd: 1(-0.753,0) 2(0.753,0)
RELAY-TH_SRD-XXVDC-XL-C
  round 2.794 hole 1.524: 1(-5.1,-6) 2(7.1,-6) 3(7.1,6) 4(-5.1,6) 5(-7.1,0)
SMA_L4.3-W2.5-LS5.0-RD
  rect 2x1.593 smd: 1(-2.1,0) 2(2.1,0)
SMA_L4.3-W2.6-LS5.0-FD
  rect 1.8x1.62 smd: 1(-2.15,-0.009) 2(2.15,0.009)
SOIC-8_L4.9-W3.9-P1.27-LS6.0-BL
  oval 0.588x2.045 smd: 1(-1.905,-2.57) 2(-0.635,-2.57) 3(0.635,-2.57) 4(1.905,-2.57) 5(1.905,2.57) 6(0.635,2.57) 7(-0.635,2.57) 8(-1.905,2.57)
SOIC-14_L8.7-W3.9-P1.27-LS6.0-BL
  oval 0.574x2.038 smd: 1(-3.81,-2.619) 2(-2.54,-2.619) 3(-1.27,-2.619) 4(0,-2.619) 5(1.27,-2.619) 6(2.54,-2.619) 7(3.81,-2.619) 8(3.81,2.619) 9(2.54,2.619) 10(1.27,2.619) 11(0,2.619) 12(-1.27,2.619) 13(-2.54,2.619) 14(-3.81,2.619)
SOP-8_L4.9-W3.9-P1.27-LS6.0-BL
  oval 0.63x1.865 smd: 1(-1.905,-2.683) 2(-0.635,-2.683) 3(0.635,-2.683) 4(1.905,-2.683) 5(1.905,2.683) 6(0.635,2.683) 7(-0.635,2.683) 8(-1.905,2.683)
SOT-23-5_L3.0-W1.7-P0.95-LS2.8-BR
  rect 1.1x0.6 smd: 1(1.3,-0.95) 2(1.3,0) 3(1.3,0.95) 4(-1.3,0.95) 5(-1.3,-0.95)
SOT-23_L2.9-W1.3-P1.90-LS2.4-BR
  rect 1x0.8 smd: 1(1.15,-0.95) 2(1.15,0.95) 3(-1.15,0)
TO-263-5_L10.2-W8.6-P1.70-LS14.4-BR
  rect 3.5x1.02 smd: 1(5.127,-3.4) 2(5.127,-1.7) 3(5.127,0) 4(5.127,1.7) 5(5.127,3.4)
  rect 8.705x10.587 smd: 6(-5.127,0)

## Nets
As in the schematic.

Pads without a net: RLY1 3; U2 1; U4 11; U8 1; U9 1

## Via types
v1: diameter 0.61, hole 0.305, Top Layer to Bottom Layer, 148 vias

## Routing (per net, layer and track width the routed paths; a pad name or vN(x,y) marks a point on that pad's centre or on a via; arc(x,y) is an arc through that point)
+5V: length 291.4
  Top Layer w0.762: 19.76,4.71 19.76,3.34 19.79,3.32 ; 14.18,47.53 11.39,47.53 10.67,46.82 10.67,38.62 ; 34.36,10.2 34.36,11.56 ; 10.67,38.62 10.67,37.04 9.73,36.1 L1.1 ; 10.67,38.62 15.55,38.62 C2.1 ; 38.51,30.18 36.88,30.18 36.88,30.11 ; v1(11.21,11.02) 11.19,11.04 9.37,11.04 ; 40,8.51 35.93,8.51 34.49,9.94 ; 44.67,33.24 47.03,33.24 47.57,33.78 47.57,35.42 48.74,36.6 48.84,36.6 49.21,36.96 ; 42.44,20.47 42.42,20.49 40.91,20.49 ; 16.45,28.46 16.45,27.64 v1(16.47,27.63) ; 23.6,23.64 23.6,19.74 23.58,19.72 ; 32.96,20.8 32.96,19.24 ; 6.87,9.3 6.87,10.75 ; 38.21,28.92 38.21,30.04 ; 18.98,25.9 18.98,22.58 20.77,20.78 20.77,19.56 ; 49.8,38.77 49.76,38.74 49.76,37.02 ; 38.06,40.5 38.06,44.21 40.65,46.79 42.4,46.79 ; 5.52,36.2 5.52,14.23 ; 5.84,13.91 7.21,12.54 7.21,11.16 ; 6.83,6.58 6.86,6.61 6.86,7.24 ; 20.76,19.54 20.8,19.51 20.8,16.1 ; 29.39,11.62 27.03,9.25 24.99,9.25 ; 42.68,46.97 42.27,46.56 42.27,42.95 ; 49.97,39.11 49.97,40.9 51.02,41.94 54.44,41.94 55.66,40.72 55.66,39 ; 34.27,11.57 34.27,14.34 34.27,14.34 ; 48.14,8.27 48.14,6.72 46.61,5.19 32.95,5.19 31.75,6.4 ; C9.1 U4.14 ; 32.68,20.54 28.16,20.54 27.84,20.22 27.77,20.22 27.15,19.61 ; 18.27,10.67 19.26,10.67 20.38,9.55 20.38,8 19.91,7.52 ; R6.2 R7.1 R20.1 R11.1 ; 22.49,7.41 24.3,9.22 ; 38.21,40.38 36.99,40.38 34.67,38.06 34.67,32.99 36.88,30.78 ; 40.18,8.53 48.07,8.53 ; 19.82,7.31 20.57,7.31 ; v1(16.05,15.28) 16.05,15.87 15.02,16.9 14.15,16.9 14,16.75 ; C8.2 U3.3 ; 20.84,19.56 26.57,19.56 ; U9.8 30.24,13.46 C4.1
  Bottom Layer w0.762: 20.7,16.05 32.46,16.05 34.22,14.29 ; 16.47,27.71 22.68,27.71 23.58,26.81 23.58,23.53 ; 22.47,7.58 22.47,14.37 20.88,15.95 ; 16.01,15.29 13.72,15.29 12.95,14.52 12.95,12.91 11.11,11.07 ; 16.06,15.32 20.03,15.32 20.75,16.04 ; 43.95,33.3 43.95,41.27 42.3,42.92 ; 23.67,23.64 28.99,28.97 38.08,28.97 ; 6.85,7.6 6.87,7.62 v1(6.87,9.27) ; 42.35,20.52 38.21,24.67 38.21,28.81 ; 20.64,7.38 22.34,7.38 ; 19.79,3.23 21.56,3.23 22.53,4.2 22.53,7.43
  vias: v1(6.86,7.57) v1(19.79,3.23) v1(20.67,7.32) v1(20.81,16.11) v1(22.48,7.41) v1(23.62,23.6) v1(34.26,14.25) v1(38.19,28.95) v1(42.32,42.85) v1(42.44,20.44) v1(43.93,33.22)
+24VIN: length 13
  Top Layer w0.762: H4.1 2.77,56.24 C1.1 12.92,52.66 12.97,52.61
GND: length 5.2
  Top Layer w0.762: H4.2 5.57,58.78 C1.2
  vias: v1(0.83,47.45) v1(0.86,46.77) v1(1.09,52.49) v1(1.15,51.31) v1(1.75,47.37) v1(1.77,46.69) v1(2.27,52.51) v1(2.35,51.26) v1(4.11,0.72) v1(5.54,12.52) v1(5.56,9.45) v1(5.94,0.75) v1(7.7,0.79) v1(8.91,59.61) v1(11.12,59.58) v1(11.08,17.03) v1(12.91,57.98) v1(12.87,54.88) v1(12.95,56.57) v1(14.67,57.99) v1(14.68,56.54) v1(14.74,54.9) v1(16.39,58) v1(16.42,56.45) v1(16.42,54.81) v1(17.55,12.45) v1(18.05,23.47) v1(19.39,8.85) v1(19.64,13.02) v1(20.64,24.31) v1(20.77,22.74) v1(20.76,10.7) v1(20.95,5.91) v1(20.96,4.85) v1(22.31,0.9) v1(22.38,24.36) v1(22.54,22.85) v1(23.5,56.29) v1(23.57,58.6) v1(23.71,5.89) v1(23.83,4.73) v1(24.1,0.99) v1(24.99,58.56) v1(24.99,56.47) v1(25.93,1.02) v1(26.32,58.62) v1(26.42,56.27) v1(27.01,42.7) v1(28.26,35.4) v1(28.3,33.99) v1(28.22,32.31) v1(29.18,17.33) v1(30.02,35.42) v1(30.04,33.97) v1(30.09,32.33) v1(31.41,22.17) v1(31.7,42.7) v1(31.75,35.43) v1(31.77,33.87) v1(31.78,32.23) v1(31.96,46.91) v1(32.06,49.39) v1(32.22,52.03) v1(32.25,54.59) v1(32.63,26.99) v1(32.72,25.69) v1(34.61,27.11) v1(35.03,25.6) v1(36.16,54.48) v1(36.19,52.19) v1(36.22,3.9) v1(36.37,6.5) v1(36.5,49.18) v1(36.63,46.86) v1(36.87,42.7) v1(38.05,6.57) v1(38.23,3.82) v1(40.27,2.29) v1(40.31,0.88) v1(40.85,34.38) v1(41.29,32.87) v1(42.03,2.31) v1(42.05,0.86) v1(42.2,32.02) v1(43.76,2.32) v1(43.78,0.76) v1(48.08,31.82) v1(49.6,23.68) v1(49.64,26.77) v1(49.68,25.36) v1(51.23,29.98) v1(51.4,26.78) v1(51.42,25.34) v1(51.47,23.7) v1(52.32,58.67) v1(52.26,55.91) v1(52.32,53.62) v1(52.44,50.86) v1(52.64,47.13) v1(52.72,43.59) v1(52.7,38.76) v1(52.77,40.64) v1(52.84,37.02) v1(53.13,26.79) v1(53.15,25.24) v1(53.16,23.6) v1(57.02,58.67) v1(56.96,55.91) v1(57.02,53.62) v1(57.13,50.86) v1(57.34,47.13) v1(57.59,25.09) v1(57.63,28.18) v1(57.67,26.77) v1(59.39,28.19) v1(59.41,26.75) v1(59.46,25.11) v1(61.11,28.2) v1(61.14,26.65) v1(61.14,25.01) v1(62.19,58.67) v1(62.13,55.91) v1(62.19,53.62) v1(62.3,50.86) v1(62.51,47.13)
CURRENT: length 5.5
  Top Layer w0.381: U9.5 30.23,7.95 R18.1 30.23,6.42 30.23,2.62 30.13,2.53
OIL1: length 12.4
  Top Layer w0.381: H2.4 R14.1 4.33,9.09 4.95,8.46 U3.5
OIL2: length 10.8
  Top Layer w0.381: U3.7 8.26,5.92 7.87,5.54 6.35,5.54 5.72,6.17 5.72,6.18 R15.1 3.81,8.09 3.81,9.61 H2.3
OIL3: length 22.8
  Top Layer w0.381: 16.67,4.53 6.01,4.53 2.03,8.5 H2.2 ; 16.67,4.53 16.64,4.56 16.64,6.81 16.26,7.19 U3.9 ; 16.67,4.53 R16.1
OIL4: length 37.2
  Top Layer w0.381: U3.11 15.88,9.73 R17.1 17.55,11.4 21.22,11.4 21.65,10.97 21.65,3.43 20.62,2.4 5.94,2.4 H2.1
OUT: length 21.9
  Top Layer w0.381: U8.2 37.21,19.51 36.83,19.89 36.83,21.04 37.21,21.42 40.13,21.42 43.05,24.34 43.05,34.12 43.43,34.5 44.67,34.5
SC_IN: length 21.1
  Bottom Layer w0.381: H3.1 43.94,4.91 43.31,5.54 43.31,13.04 44.72,14.45 RLY1.5
SC_OUT: length 7.6
  Bottom Layer w0.381: RLY1.2 60.45,8.44 60.45,6.18 59.18,4.91 H3.2
$1N1139: length 19.9
  Top Layer w0.381: 11.18,8.68 11.18,7.58 10.78,7.18 9.33,7.18 U3.6 ; 11.18,8.68 12.1,8.68 12.58,8.2 12.69,8.2 ; 11.18,8.68 11.18,9.23 10.67,9.73 U3.4 ; 12.69,8.2 12.95,8.46 U3.10 15.75,8.46 16.26,8.97 C6.1 18.3,7.5 R24.1 R23.2 ; 12.69,8.2 12.32,7.83 12.32,6.56 12.84,6.04 14.45,6.04 U3.8
$1N1617: length 22.7
  Top Layer w0.381: 9.64,25.99 U4.1 ; 9.64,25.99 9.02,25.99 8.64,25.61 8.64,14.6 7.96,13.92 7.96,13.1 8.78,12.27 U3.2 ; 9.64,25.99 9.65,26 9.65,29.8 9.9,30.05 R6.1
$1N1644: length 28.6
  Top Layer w0.381: R11.2 17.73,30.05 18.18,29.6 18.18,27.8 17.22,26.84 15.69,26.84 14.86,26.01 14.86,21.29 14.48,20.91 U4.5 10.29,20.91 9.86,20.49 9.86,14.86 11.18,13.54 U3.14
$1N2028: length 6.6
  Top Layer w0.381: U9.6 31.04,9.23 31.81,9.99 R5.1 R4.2 33.46,7.65 C7.1
$1N2830: length 19.1
  Top Layer w0.381: 38.67,35.25 38.73,35.19 38.73,34.12 38.24,33.62 R22.2 36.45,33.49 36.45,32.59 36.9,32.15 U2.4 38.58,32.82 39.38,33.62 v1(39.65,33.62) ; 45.79,29.03 v1(44.83,29.03)
  Bottom Layer w0.254: v1(44.83,29.03) 43.31,29.03 43.05,29.29 43.05,32.47 41.9,33.62 v1(39.65,33.62)
$1N2952: length 9.1
  Top Layer w0.381: R9.1 39.62,40.22 39.62,38.82 ; 39.62,38.82 40.51,38.82 43.56,35.77 44.67,35.77 ; 39.62,38.82 Q1.3
$1N3199: length 20.6
  Top Layer w0.381: U7.7 U7.6 53.08,34.5 ; 47.69,29.03 53.71,29.03 54.1,29.42 C3.1 54.1,38.7 53.98,38.82
$1N3222: length 1.6
  Top Layer w0.381: U7.5 49.81,31.8 C5.2
$1N3577: length 1.6
  Top Layer w0.381: U8.4 40.92,17.01 Q3.1
$1N3579: length 15.7
  Top Layer w0.381: D1.2 Q3.3 40.13,14.56 43.56,14.56 44.07,15.07 44.07,20.02 44.5,20.45 RLY1.4
$1N6050: length 15.9
  Top Layer w1.016: 12.97,50.91 9.91,50.91 ; 9.91,50.91 9.91,47.45 8,45.55 5.64,45.55 L1.2 ; 9.91,50.91 8.01,50.91 D2.2
$1N6054: length 1.8
  Top Layer w0.381: 44.34,46.88 46.09,46.88 46.12,46.84
$1N6066: length 13.3
  Top Layer w0.381: U3.13 15.75,12.27 16.89,13.42 16.89,17.18 17.82,18.11 17.82,19.49 ; 19.19,19.64 19.03,19.49 17.82,19.49 ; 17.82,19.49 17.82,20.61 17.53,20.91 U4.10
$1N6081: length 23.2
  Top Layer w0.381: U3.1 9.32,23.88 10.16,24.72 ; 10.16,24.72 10.16,24.87 v1(9.78,25.25) ; 10.16,24.72 U4.2 ; R7.2 v1(12.83,31.32)
  Bottom Layer w0.381: v1(12.83,31.32) 10.29,31.32 9.78,30.82 9.78,25.48
$1N6083: length 19.5
  Top Layer w0.381: v1(9.99,22.81) 10.63,22.18 U4.4 U4.3 ; v1(14.55,31.32) 14.55,30.09 R20.2
  Bottom Layer w0.381: 9.78,22.81 9,23.59 9,31.94 9.27,32.21 13.67,32.21 v1(14.55,31.32)
$1N6088: length 8.5
  Top Layer w0.381: 12.7,18.44 12.75,18.5 13.72,18.5 14.86,19.64 U4.9 ; 12.7,18.44 12.7,16.96 R21.2 ; 12.7,18.44 12.7,19.13 12.19,19.64 U4.6
$1N6089: length 16.7
  Top Layer w0.381: U4.8 16.13,18.04 v1(16.13,16.97) ; U5.1 30.26,19.26 R19.2 26.92,17.73 v1(26.42,17.73)
  Bottom Layer w0.381: v1(26.42,17.73) 18.42,17.73 17.65,16.97 v1(16.13,16.97)
$1N6114: length 10.8
  Top Layer w0.381: U9.7 31.5,10.5 R13.2 32.65,14.68 32.04,15.29 32.04,16.84 32.03,16.85 32.03,17.2 30.99,18.24 U5.2
$1N6121: length 9.1
  Top Layer w0.381: R8.1 39.74,27.06 C11.2 41.15,27.13 42.42,28.4 42.42,30.56 41.78,31.2 U2.2
$1N6129: length 11.5
  Top Layer w0.381: U5.4 33.59,17.29 34.42,18.12 34.42,22.43 35.43,23.45 37.72,23.45 38.24,23.97 R8.2

## Copper pours and planes (outline as drawn; the poured copper is in the pictures)
GND on Top Layer: -0.08,60.24 64.84,60.24 64.84,0.13 -0.08,0.13
GND on Bottom Layer: -0.09,60.26 64.82,60.26 64.82,0.13 -0.09,0.13

Small or netless copper shapes (teardrops, artwork), in the pictures only: 159 on Top Layer, 15 on Bottom Layer
